# Altium schematic sheet clock.SchDoc
size A4
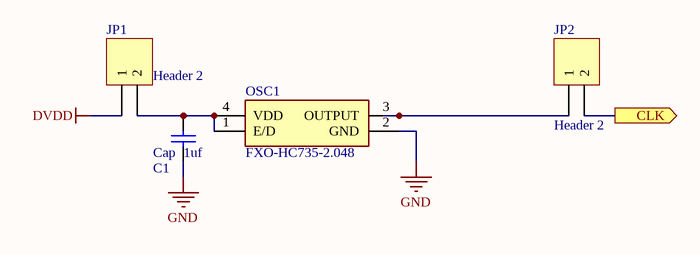
[diagram p0: clock.SchDoc]

## Parts
C1  Cap  value 1uf  [1608[0603]]
JP1  Header 2  [HDR1X2]
JP2  Header 2  [HDR1X2]
OSC1  FXO-HC735-2.048  [FXO-HC736R-40]

## Ports
CLK (out)

## Nets
DVDD: JP1.1
GND: C1.1 OSC1.2(GND)
CLK: JP2.2 ; port CLK
NetC1_2: C1.2 JP1.2 OSC1.1(E/D) OSC1.4(VDD)
NetJP2_1: JP2.1 OSC1.3(OUTPUT)

## Library data of the parts
C1 = Cap: Capacitor; Published: 8-Jun-2000; LatestRevisionDate: 17-Jul-2002; LatestRevisionNote: Re-released for DXP Platform.; PackageReference: RAD-0.3; Publisher: Altium Limited; PackageDescription: Radial Cap, Thru-Hole; 2 Leads; 0.3 in Pin Spacing
JP1 JP2 = Header 2: Header, 2-Pin; LatestRevisionDate: 17-Jul-2002; LatestRevisionNote: Re-released for DXP Platform.; Publisher: Altium Limited
OSC1 = FXO-HC735-2.048: Crystal or Oscillator; Manufacturer_Name: IDT; Datasheet Link: https://media.digikey.com/pdf/Data%20Sheets/Renesas/R7F7010293AFP_Web.pdf; Manufacturer_Part_Number: FXO-HC735-2.048; Mouser Part Number: XPO-HC735-2.048; Mouser Price/Stock: https://www.mouser.com/Search/Refine.aspx?Keyword=XPO-HC735-2.048